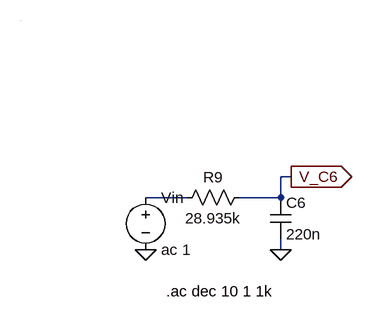
[diagram p0: schematic LPF.asc]
LPF.asc, the LTspice schematic file:
Version 4
SHEET 1 880 680
WIRE 416 240 400 240
WIRE 256 272 192 272
WIRE 400 272 400 240
WIRE 400 272 336 272
WIRE 400 352 400 336
WIRE 0 0 0 0
FLAG 192 352 0
FLAG 400 352 0
FLAG 416 240 V_C6
IOPIN 416 240 Out
SYMBOL Voltage 192 256 R0
SYMATTR InstName Vin
SYMATTR Value ac 1
SYMBOL res 352 256 R90
WINDOW 0 0 56 VBottom 2
WINDOW 3 32 56 VTop 2
SYMATTR InstName R9
SYMATTR Value 28.935k
SYMBOL cap 384 272 R0
SYMATTR InstName C6
SYMATTR Value 220n
TEXT 224 416 Left 2 !.ac dec 10 1 1k

The netlist it stands for:
* LPF.asc
Vin N001 0 ac 1
R9 V_C6 N001 28.935k
C6 V_C6 0 220n
.ac dec 10 1 1k
.backanno
.end